# EAGLE design LED (EAGLE 7.6.0)
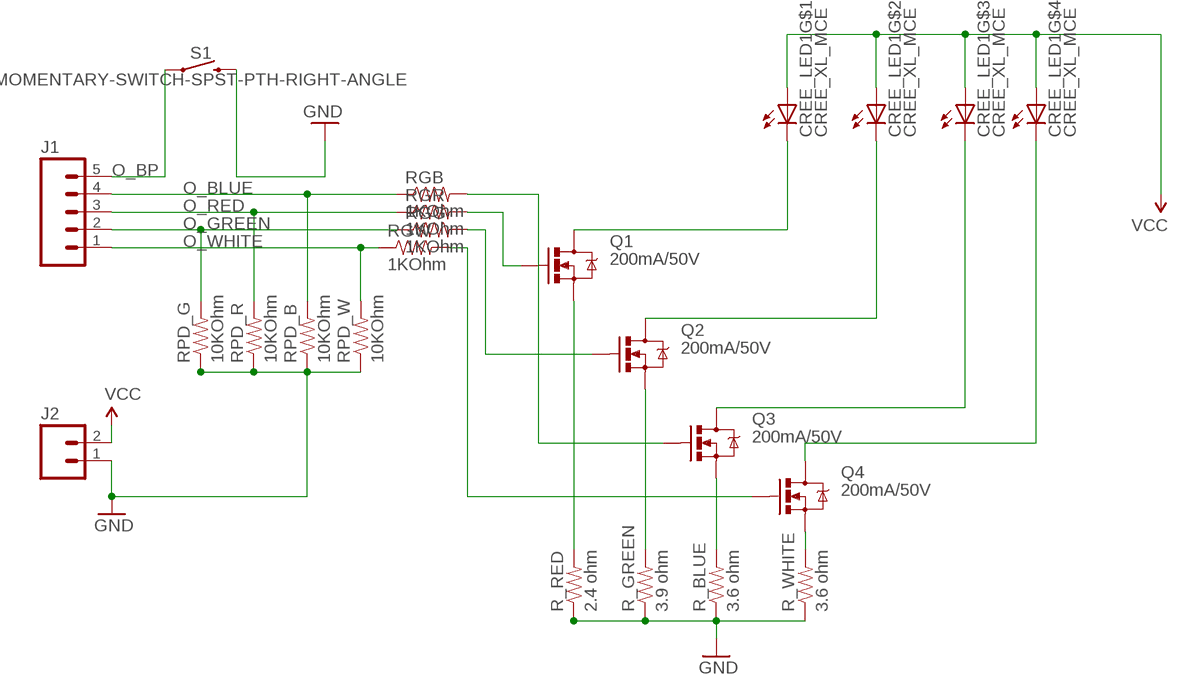
[diagram p0: schematic, sheet 1]

## Parts
CREE_LED1  CREE_XL_MCE  [CREE_XL_MCE]
J1  M05NO_SILK  [1X05_NO_SILK]
J2  M021X02_NO_SILK  [1X02_NO_SILK]
Q1  200mA/50V  MOSFET-NCHANNELBSS138  [SOT23-3]
Q2  200mA/50V  MOSFET-NCHANNELBSS138  [SOT23-3]
Q3  200mA/50V  MOSFET-NCHANNELBSS138  [SOT23-3]
Q4  200mA/50V  MOSFET-NCHANNELBSS138  [SOT23-3]
R_BLUE  3.6 ohm  RESISTOR0805-RES  [0805]
R_GREEN  3.9 ohm  RESISTOR0805-RES  [0805]
R_RED  2.4 ohm  RESISTOR0805-RES  [0805]
R_WHITE  3.6 ohm  RESISTOR0805-RES  [0805]
RGB  1KOhm  RESISTOR0805-RES  [0805]
RGG  1KOhm  RESISTOR0805-RES  [0805]
RGR  1KOhm  RESISTOR0805-RES  [0805]
RGW  1KOhm  RESISTOR0805-RES  [0805]
RPD_B  10KOhm  RESISTOR0805-RES  [0805]
RPD_G  10KOhm  RESISTOR0805-RES  [0805]
RPD_R  10KOhm  RESISTOR0805-RES  [0805]
RPD_W  10KOhm  RESISTOR0805-RES  [0805]
S1  MOMENTARY-SWITCH-SPST-PTH-RIGHT-ANGLE  [TACTILE_SWITCH_PTH_RIGHT_ANGLE]

## Nets
GND: J2.1 R_BLUE.1 R_GREEN.1 R_RED.1 R_WHITE.1 RPD_B.1 RPD_G.1 RPD_R.1 RPD_W.1 S1.2
N$1 [SUPPLY]: Q3.2(S) R_BLUE.2
N$2 [SUPPLY]: Q2.2(S) R_GREEN.2
N$3 [SUPPLY]: Q1.2(S) R_RED.2
N$4: Q2.1(G) RGG.2
N$5: Q1.1(G) RGR.2
N$6: Q3.1(G) RGB.2
N$8: Q4.2(S) R_WHITE.2
N$9 [SUPPLY]: CREE_LED1.6(C) Q3.3(D)
N$10 [SUPPLY]: CREE_LED1.8(C) Q1.3(D)
N$11 [SUPPLY]: CREE_LED1.7(C) Q2.3(D)
N$13: Q4.1(G) RGW.2
N$14 [SUPPLY]: CREE_LED1.5(C) Q4.3(D)
O_BLUE: J1.4 RGB.1 RPD_B.2
O_BP: J1.5 S1.1
O_GREEN: J1.2 RGG.1 RPD_G.2
O_RED: J1.3 RGR.1 RPD_R.2
O_WHITE: J1.1 RGW.1 RPD_W.2
VCC [SUPPLY]: CREE_LED1.1(A) CREE_LED1.2(A) CREE_LED1.3(A) CREE_LED1.4(A) J2.2
Unconnected: CREE_LED1.HT(TH:TH)

## Library data of the parts
CREE_LED1 = CreeXL-MC-E:CREE_XL_MCE: Cree® LED
J1 = SparkFun-Connectors:M05: Header 5 Standard 5-pin 0.1" header. Use with straight break away headers (SKU : PRT-00116), right angle break away headers (PRT-00553), swiss pins (PRT-00743), machine pins (PRT-00117), and female headers (PRT-00115). Molex polarized connector foot print use with SKU : PRT-08230 with associated crimp pins and housings.
J2 = SparkFun-Connectors:M02: Standard 2-pin 0.1" header. Use with - straight break away headers ( PRT-00116) - right angle break away headers (PRT-00553) - swiss pins (PRT-00743) - machine pins (PRT-00117) - female headers (PRT-00115) Molex polarized connector foot print use with: PRT-08233 with associated crimp pins and housings. 2.54_SCREWTERM for use with PRT-10571. 3.5mm Screw Terminal footprints for PRT-08084 5mm Screw Terminal footprints for use with PRT-08432
Q1-Q4 = SparkFun-DiscreteSemi:MOSFET-NCHANNEL: Common NMOSFET Parts MFG P/N Store ID Prod ID FDD8780 TRANS-09984 SI7820DN TRANS-11055 FDS6630A IC-08089 2N7002PW TRANS-11151 FQP30N06L COM-10213 TRANS-10060 BSS123LT1G TRANS-08345 BSS138 TRANS-00830 BS170 2N7000; PROD_ID: TRANS-00830
R_BLUE R_GREEN R_RED R_WHITE RGB RGG RGR RGW RPD_B RPD_G RPD_R RPD_W = SparkFun-Resistors:RESISTOR: Resistor Basic schematic elements and footprints for 0603, 1206, and PTH resistors.
S1 = SparkFun-Switches:MOMENTARY-SWITCH-SPST: Momentary Switch (Pushbutton) - SPST Normally-open (NO) SPST momentary switches (buttons, pushbuttons). Variants PTH-12MM - 12mm square, through-hole Momentary Pushbutton Switch - 12mm Square <https://www.sparkfun.com/products/9190> (COM-09190) PTH-6.0MM, PTH-6.0MM-KIT - 6.0mm square, through-hole Mini Pushbutton Switch <https://www.sparkfun.com/products/97> (COM-00097) KIT package intended for soldering kit's - only one side of pads' copper is exposed. PTH-RIGHT-ANGLE-KIT - Right-angle, through-hole Right Angle Tactile Button <https://www.sparkfun.com/products/10791> - Used on SparkFun BigTime Watch Kit <https://www.sparkfun.com/products/11734> SMD-12MM - 12mm square, surface-mount Tactile Button - SMD (12mm) <https://www.sparkfun.com/products/12993> (COM-12993) Used on SparkFun PicoBoard <https://www.sparkfun.com/products/11888> SMD-4.5MM - 4.5mm Square Trackball Switch Used on SparkFun Blackberry Trackballer Breakout <https://www.sparkfun.com/products/13169> SMD-4.6MMX2.8MM - 4.60mm x 2.80mm, surface mount Used on SparkFun SAMD21 Mini Breakout <https://www.sparkfun.com/products/13664> SMD-5.2MM, SMD-5.2-REDUNDANT - 5.2mm square, surface-mount Mini Pushbutton Switch - SMD <https://www.sparkfun.com/products/8720> (COM-08720) Used on Arduino Pro Mini <https://www.sparkfun.com/products/11114> REDUNDANT package connects both switch circuits together SMD-6.0X3.5MM - 6.0 x 3.5mm, surface mount Momentary Reset Switch SMD <https://www.sparkfun.com/products/8229> (COM-08229) SMD-6.2MM-TALL - 6.2mm square, surface mount Tactile Button - SMD (6mm) <https://www.sparkfun.com/products/12992> Used on SparkFun Digital Sandbox <https://www.sparkfun.com/products/12651> SMD-RIGHT-ANGLE - Right-angle, surface mount Used on SparkFun Block for Intel® Edison - Arduino <https://www.sparkfun.com/products/13036>; PROD_ID: CONN-10672; SF_SKU: COM-10791

## Net classes
0 default: width 0.3 mm
1 GND: width 0.5 mm, clearance 0.5 mm
2 SUPPLY: width 0.5 mm, clearance 0.003 mm

## Board
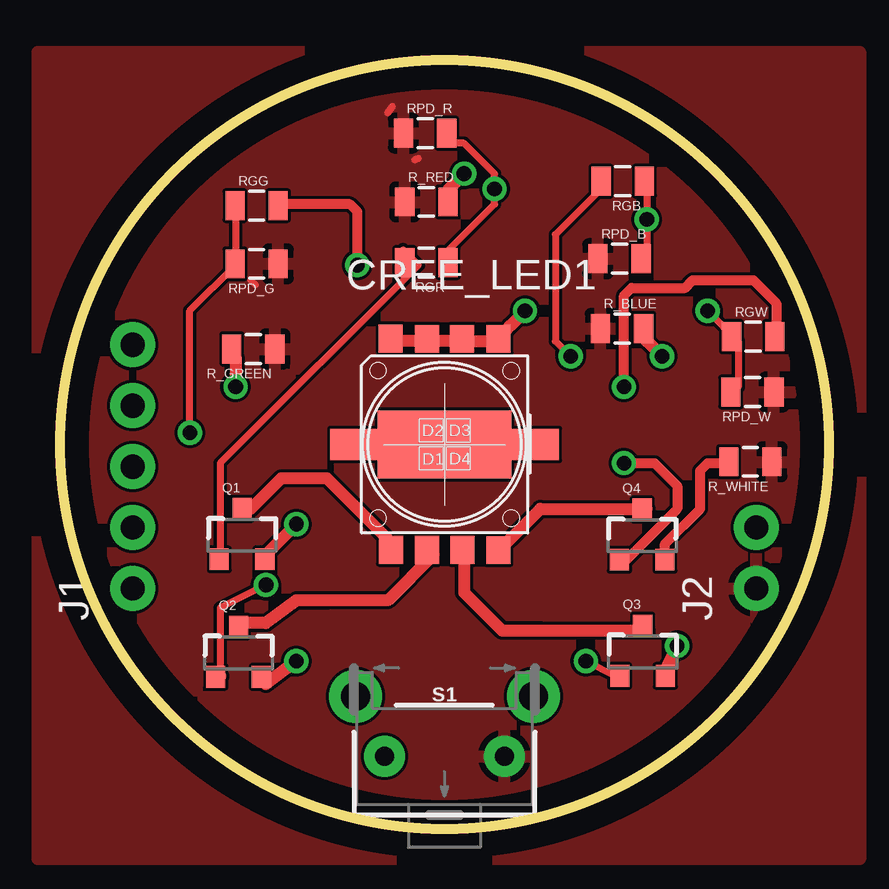
[diagram p1: board, top side]
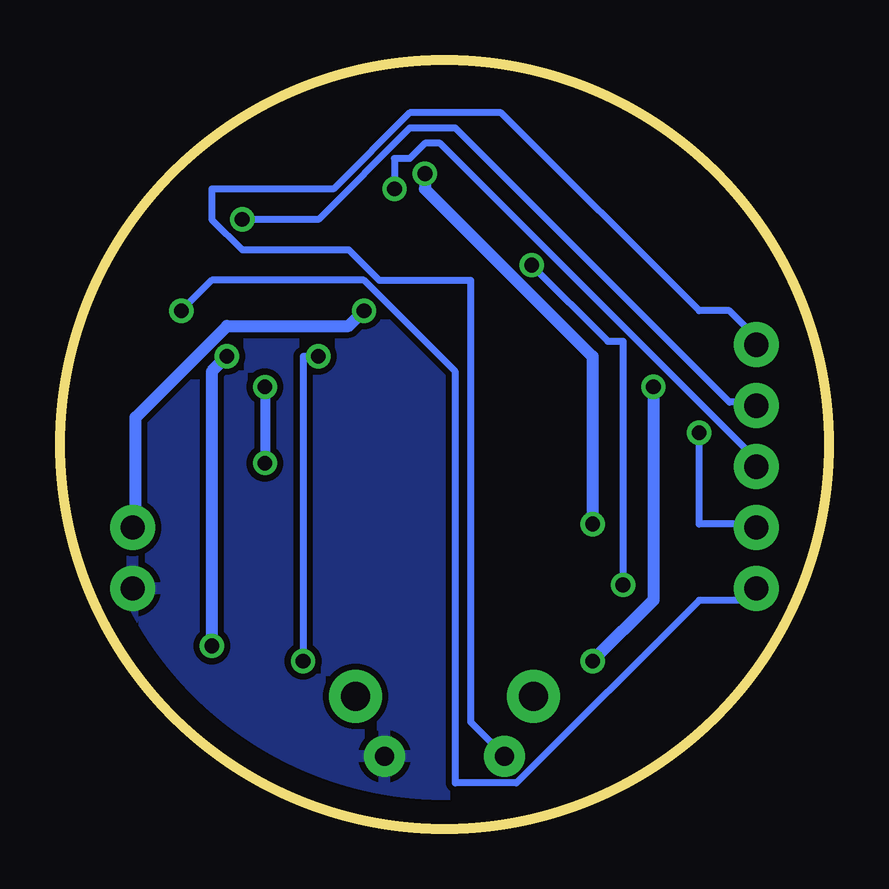
[diagram p2: board, bottom side, seen from below]

Size 32.06 x 32.06 mm. Coordinates in mm from the lower left corner, seen from the top.
Outline: circle at 16.03,16.03 radius 16.03
Copper layers (1*16): Top 0.035mm / dielectric 1.5mm / Bottom 0.035mm
Design rules "baballe": minimum track width 5mil, minimum drill 24mil, track to track 4mil, track to pad 4mil, pad to pad 4mil, via to via 4mil, smd to smd 2mil, copper to edge 40mil, drill to drill 8mil, minimum pad ring 10mil, minimum via ring 8mil, stop-mask expansion 4mil, vias tented up to drill 0mil, thermal gap 10mil

### Footprints (pad centres in the part's own frame; a part is rotated, then mirrored left to right if it is on the bottom)
CREE_XL_MCE = smd 1 x 1.16: 1 -2.24,4.42; 2 -0.739,4.408; 3 0.739,4.408; 4 2.256,4.408; 5 2.246,-4.408; 6 0.749,-4.399; 7 -0.739,-4.399; 8 -2.237,-4.399 | smd 5.6 x 2.84: HT 0,0 | smd 2 x 1.3: P$9 3.778,0; P$10 -3.767,0
1X05_NO_SILK = drill 1.016 pad 1.88: 1 0,0; 2 2.54,0; 3 5.08,0; 4 7.62,0; 5 10.16,0
1X02_NO_SILK = drill 1.016 pad 1.88: 1 0,0; 2 2.54,0
SOT23-3 = smd 0.8 x 0.9: 1 -0.95,-1; 2 0.95,-1; 3 0,1.1
0805 = smd 0.8 x 1.2: 1 -0.9,0; 2 0.9,0
TACTILE_SWITCH_PTH_RIGHT_ANGLE = drill 0.8 pad 1.7: 1 -2.5,0; 2 2.5,0 | drill 1.2 pad 2.2: ANCHOR1 -3.703,2.5; ANCHOR2 3.703,2.5

### Placement (x,y rotation side)
CREE_LED1  16.03,16.03 0 top
J1  3.03,10.03 90 top
J2  29.03,10.03 90 top
Q1  7.59,12.24 0 top
Q2  7.44,7.34 0 top
Q3  24.29,7.38 0 top
Q4  24.27,12.22 0 top
R_BLUE  23.43,20.87 0 top
R_GREEN  8.06,20.02 180 top
R_RED  15.28,26.15 0 top
R_WHITE  28.78,15.31 180 top
RGB  23.47,27.01 180 top
RGG  8.2,25.99 0 top
RGR  15.28,23.61 180 top
RGW  28.9,20.53 0 top
RPD_B  23.33,23.78 0 top
RPD_G  8.2,23.56 180 top
RPD_R  15.22,29.01 0 top
RPD_W  28.87,18.22 180 top
S1  16.03,3.03 0 top

### Tracks (layer width: path | path; a pad name or v marks a point on that pad's centre or on a via)
GND
  Top 0.3: 13.67,29.86 13.85,30.12 | 7.96,22.88 8.14,22.69 | 9.23,23.51 9.1,23.51 | 14.94,27.96 14.79,27.9
  pour Bottom (isolate 0.254): -0.97,32.03 33.03,32.03 33.03,-0.97 -0.97,-0.97
  pour Top (isolate 0.127): -0.93,32.4 33.36,32.4 33.36,-1.25 -0.93,-1.25
N$1  (via drill 0.61)
  Top 0.5: v25.74,7.64 25.16,6.49 25.1,6.37 | v25.1,19.7 24.47,20.34 R_BLUE.2
  Top 0.508: Q3.2 25.24,6.42 25.16,6.49
  Bottom 0.5: v25.74,7.64 25.74,19.07 v25.1,19.7
N$2  (via drill 0.61)
  Top 0.5: v9.86,7 8.59,6.05 Q2.2 | v7.32,18.43 7.32,19.7 R_GREEN.2
  Bottom 0.5: v9.86,7 7.32,9.54 v7.32,18.43
N$3  (via drill 0.61)
  Top 0.5: v9.86,12.72 8.59,11.45 Q1.2 | v16.85,27.32 16.21,26.69 R_RED.2
  Bottom 0.5: v9.86,12.72 9.86,19.7 16.85,26.69 v16.85,27.32
N$4  (via drill 0.61)
  Top 0.3: 6.69,6.37 6.69,9.22 v8.59,10.18
  Top 0.406: v12.4,23.51 12.4,25.73 12.08,26.05 9.16,26.05 RGG.2
  Top 0.508: 6.69,6.37 6.52,6.37 Q2.1
  Bottom 0.3: v8.59,10.18 8.59,20.34 9.23,20.34 v12.4,23.51
N$5
  Top 0.3: Q1.1 6.69,11.45 6.69,15.26 14.94,23.51 14.31,24.15 RGR.2
N$6  (via drill 0.61)
  Top 0.3: v21.93,7 23.2,6.37 Q3.1 | v21.29,19.7 20.66,20.34 20.66,24.78 22.56,26.69 RGB.2
  Bottom 0.3: v21.93,7 21.93,19.7 v21.29,19.7
N$8
  Top 0.406: Q4.2 25.22,11.89 26.69,13.35 26.69,14.94 27.01,15.26 27.83,15.26 R_WHITE.2
N$9
  Top 0.5: 20.02,8.27 24.47,8.27 Q3.3 | 16.85,11.45 CREE_LED1.6
  Top 0.508: 16.85,11.45 16.85,9.86 18.43,8.27 20.02,8.27
N$10
  Top 0.5: Q1.3 7.96,13.35 9.23,14.62 11.13,14.62 13.67,12.08 CREE_LED1.8
N$11
  Top 0.5: 11.13,9.54 13.67,9.54 15.58,11.45 CREE_LED1.7
  Top 0.508: 11.13,9.54 9.86,9.54 8.59,8.59 7.59,8.59 Q2.3
N$13  (via drill 0.6)
  Top 0.406: Q4.1 23.61,11.22 25.74,13.35 25.74,14.3 24.78,15.26 v23.51,15.26 | v23.51,18.43 23.51,22.24 23.83,22.56 26.05,22.56 26.37,22.88 28.91,22.88 29.86,21.92 29.86,20.59 RGW.2
  Bottom 0.406: v23.51,18.43 v23.51,15.26
N$14
  Top 0.5: Q4.3 24.47,13.35 20.02,13.35 18.75,12.08 CREE_LED1.5
O_BLUE  (via drill 0.61)
  Top 0.3: RPD_B.2 24.47,24.15 v24.47,25.42 24.47,26.69 RGB.1
  Bottom 0.3: v24.47,25.42 21.29,25.42 17.48,29.23 15.58,29.23 4.15,17.8 3.51,17.8 J1.4
O_BP
  Bottom 0.3: S1.1 13.67,3.19 14.94,4.46 14.94,22.88 18.75,22.88 20.02,24.15 24.47,24.15 25.74,25.42 25.74,26.69 20.66,26.69 17.48,29.86 13.67,29.86 5.42,21.61 4.15,21.61 2.88,20.34 J1.5
O_GREEN  (via drill 0.61)
  Top 0.3: RGG.1 7.32,25.73 7.32,24.15 RPD_G.2 7.32,23.51 5.42,21.61 v5.42,16.53
  Bottom 0.3: v5.42,16.53 5.42,12.72 3.51,12.72 J1.2
O_RED  (via drill 0.61)
  Top 0.3: RPD_R.2 16.21,28.59 16.85,28.59 18.12,27.32 v18.12,26.69 18.12,26.05 16.21,24.15 RGR.1
  Bottom 0.3: v18.12,26.69 18.12,27.96 17.48,27.96 16.85,28.59 16.21,28.59 2.88,15.26 J1.3
O_WHITE  (via drill 0.61)
  Top 0.3: RPD_W.2 28.28,18.43 28.28,20.34 RGW.1 27.64,20.97 v27.01,21.61
  Bottom 0.3: v27.01,21.61 25.74,22.88 19.39,22.88 15.58,19.07 15.58,1.92 13.04,1.92 5.42,9.54 3.51,9.54 J1.1
VCC  (via drill 0.61)
  Top 0.5: 16.85,20.34 15.58,20.34 CREE_LED1.2 14.94,20.34 13.67,20.34 CREE_LED1.1 | 16.85,20.34 18.12,20.34 CREE_LED1.4 18.75,20.97 v19.39,21.61 | 16.85,20.34 CREE_LED1.3
  Bottom 0.5: v19.39,21.61 20.02,20.97 25.1,20.97 28.91,17.16 28.91,12.72 J2.2